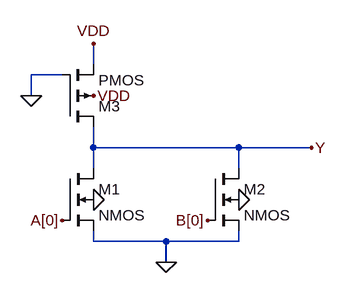
[diagram p0: schematic pseudo_nor.asc]
pseudo_nor.asc, the LTspice schematic file:
Version 4
SHEET 1 880 680
WIRE 112 -32 112 -64
WIRE 64 -16 16 -16
WIRE 16 16 16 -16
WIRE 112 96 112 64
WIRE 336 96 112 96
WIRE 448 96 336 96
WIRE 112 128 112 96
WIRE 336 128 336 96
WIRE 112 240 112 224
WIRE 224 240 112 240
WIRE 336 240 336 224
WIRE 336 240 224 240
WIRE 224 272 224 240
FLAG 224 272 0
FLAG 16 16 0
FLAG 112 176 0
FLAG 336 176 0
FLAG 112 -64 VDD
FLAG 112 16 VDD
FLAG 64 208 A[0]
FLAG 288 208 B[0]
FLAG 448 96 Y
SYMBOL nmos4 64 128 R0
SYMATTR InstName M1
SYMBOL nmos4 288 128 R0
SYMATTR InstName M2
SYMBOL pmos4 64 64 M180
SYMATTR InstName M3

The netlist it stands for:
* pseudo_nor.asc
M1 Y A[0] 0 0 NMOS
M2 Y B[0] 0 0 NMOS
M3 Y 0 VDD VDD PMOS
.model NMOS NMOS
.model PMOS PMOS
.lib standard.mos
.backanno
.end